# EAGLE design RPM meter (EAGLE 6.4)
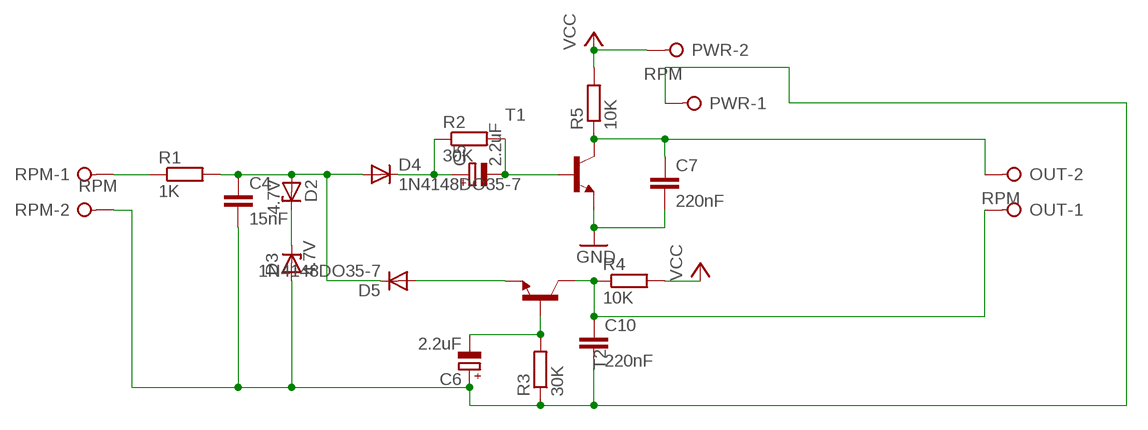
[diagram p0: schematic, sheet 1]

## Parts
C4  15nF  C-EU025-024X044  [C025-024X044]
C5  2.2uF  CPOL-EUE1.8-4  [E1,8-4]
C6  2.2uF  CPOL-EUE1.8-4  [E1,8-4]
C7  220nF  C-EU025-024X044  [C025-024X044]
C10  220nF  C-EU025-024X044  [C025-024X044]
D2  4.7V  ZENER-DIODEZD-10  [ZDIO-10]
D3  4.7V  ZENER-DIODEZD-10  [ZDIO-10]
D4  1N4148DO35-7  [DO35-7]
D5  1N4148DO35-7  [DO35-7]
OUT  RPM  W237-02P  [W237-132]
PWR  RPM  W237-02P  [W237-132]
R1  1K  R-EU_0207/7  [0207/7]
R2  30K  R-EU_0207/7  [0207/7]
R3  30K  R-EU_0207/7  [0207/7]
R4  10K  R-EU_0207/7  [0207/7]
R5  10K  R-EU_0207/7  [0207/7]
RPM  RPM  W237-02P  [W237-132]
T1  2N2222-NPN-TO92-EBC  [TO92-EBC]
T2  2N2222-NPN-TO92-EBC  [TO92-EBC]

## Nets
GND: C7.2 T1.E
N$1: C4.2 C6.+ C10.2 D3.A PWR.1 R3.1 RPM.2
N$9: R1.1 RPM.1
N$13: C4.1 D2.A D4.A D5.C R1.2
N$14: C7.1 OUT.2 R5.1 T1.C
N$20: D2.C D3.C
N$21: C5.+ D4.C R2.1
N$22: C5.- R2.2 T1.B
N$24: D5.A T2.E
N$26: C6.- R3.2 T2.B
N$28: C10.1 OUT.1 R4.1 T2.C
VCC: PWR.2 R4.2 R5.2

## Library data of the parts
C4 C7 C10 = rcl:C-EU: CAPACITOR, European symbol
C5 C6 = rcl:CPOL-EU: POLARIZED CAPACITOR, European symbol
D2 D3 = diode:ZENER-DIODE: Z-Diode
D4 D5 = diode:1N4148: DIODE high speed (Philips)
OUT PWR RPM = con-wago-508:W237-02P: WAGO SREW CLAMP; OC_FARNELL: unknown; OC_NEWARK: unknown
R1-R5 = rcl:R-EU_: RESISTOR, European symbol
T1 T2 = transistor-neu-to92:*-NPN-: NPN Transistror

## Board
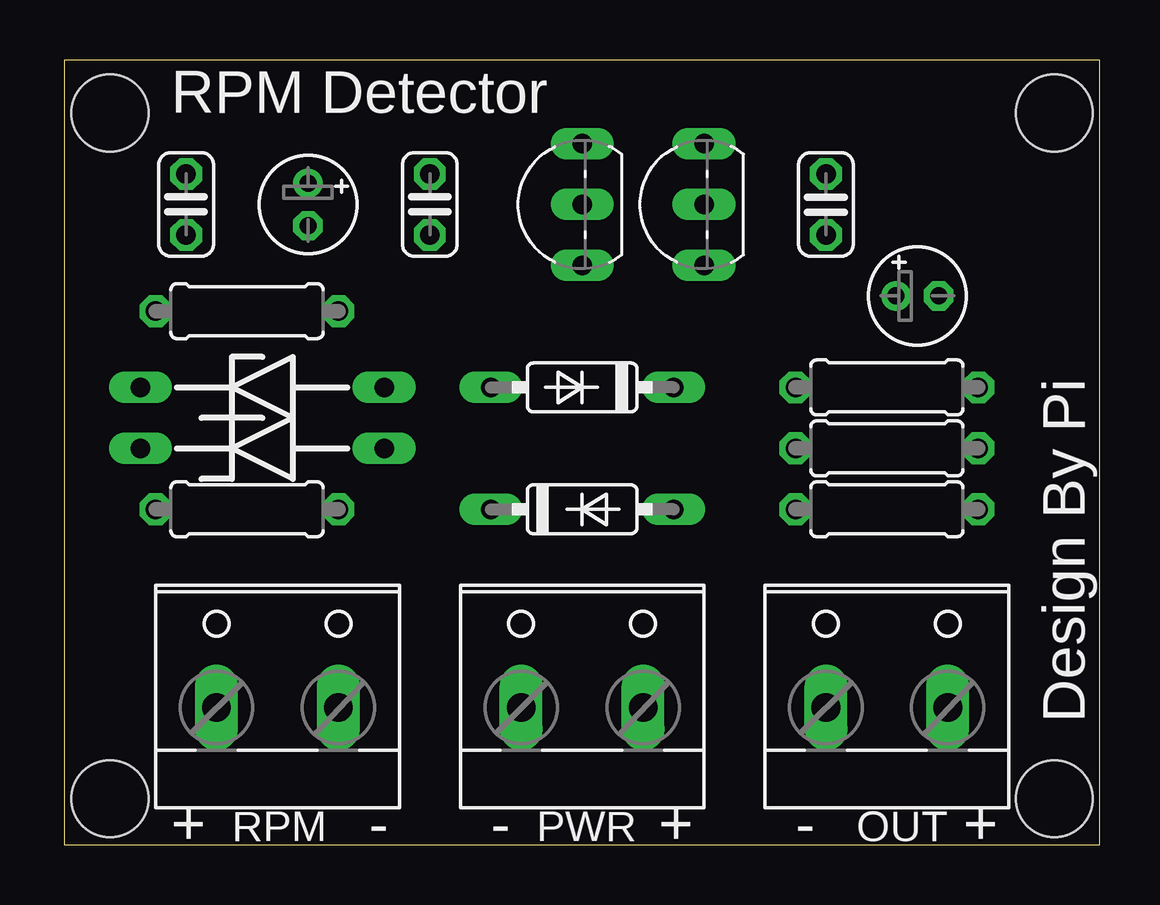
[diagram p1: board, top side]
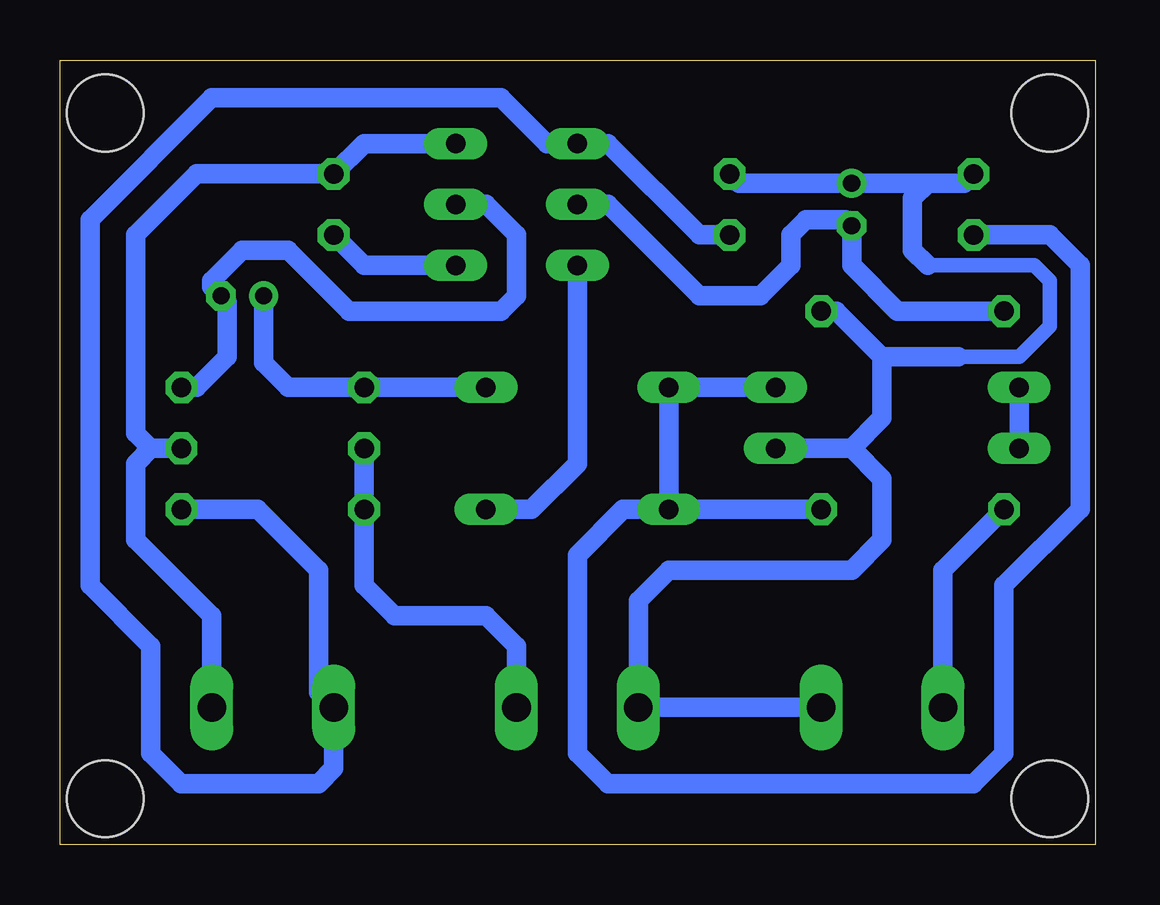
[diagram p2: board, bottom side, seen from below]

Size 43.16 x 32.69 mm. Coordinates in mm from the lower left corner, seen from the top.
Outline: 0,0 43.16,0 43.16,32.69 0,32.69 0,0
Copper layers (1*16): Top 0.035mm / dielectric 1.5mm / Bottom 0.035mm
Design rules "default": minimum track width 10mil, minimum drill 24mil, track to track 8mil, track to pad 8mil, pad to pad 8mil, via to via 8mil, smd to smd 8mil, copper to edge 40mil, drill to drill 8mil, minimum pad ring 10mil, minimum via ring 8mil, stop-mask expansion 4mil, vias tented up to drill 0mil, thermal gap 10mil
Holes 3.2 mm at 1.91,30.48 1.91,1.91 41.27,1.91 41.27,30.48

### Footprints (pad centres in the part's own frame; a part is rotated, then mirrored left to right if it is on the bottom)
C025-024X044 = drill 0.813 octagon: 1 -1.27,0; 2 1.27,0
E1,8-4 = drill 0.711 pad 1.168: + -0.889,0 | drill 0.711 pad 1.168 octagon: - 0.889,0
ZDIO-10 = drill 0.813 long: A 5.08,0; C -5.08,0
DO35-7 = drill 0.813 long: A 3.81,0; C -3.81,0
W237-132 = drill 1.194 long: 1 -2.54,-0.635; 2 2.54,-0.635
0207/7 = drill 0.813 octagon: 1 -3.81,0; 2 3.81,0
TO92-EBC = drill 0.813 long: B 0,-1.27; C 2.54,-1.27; E -2.54,-1.27

### Placement (x,y rotation side)
C4  5.08,26.67 90 top
C5  35.56,22.86 0 top
C6  10.16,26.67 270 top
C7  31.75,26.67 270 top
C10  15.24,26.67 90 top
D2  8.25,19.05 0 top
D3  8.25,16.51 0 top
D4  21.59,19.05 180 top
D5  21.59,13.97 0 top
OUT  34.29,6.35 0 top
PWR  21.59,6.35 0 top
R1  7.62,13.97 0 top
R2  34.29,19.05 0 top
R3  7.62,22.23 180 top
R4  34.29,13.97 180 top
R5  34.29,16.51 180 top
RPM  8.89,6.35 0 top
T1  25.4,26.67 90 top
T2  20.32,26.67 90 top

### Tracks (layer width: path | path; a pad name or v marks a point on that pad's centre or on a via)
GND
  Bottom 0.813: T1.E 30.48,24.13 C7.2
N$1
  Bottom 0.61: 6.99,24.13 2.54,24.13 1.91,23.5 1.91,21.59 3.17,20.32 6.35,20.32
  Bottom 0.813: D3.A 10.16,16.51 | 10.16,16.51 8.89,15.24 8.89,12.7 10.16,11.43 17.78,11.43 19.05,10.16 PWR.1 RPM.2 | 8.89,20.32 8.89,17.78 10.16,16.51 | 6.99,27.56 C6.+ 14.86,27.56 C10.2 | 6.99,27.56 5.46,27.56 C4.2 | 8.89,20.32 10.8,22.23 R3.1 | 8.89,20.32 6.35,20.32 5.72,20.32 | 6.99,24.13 7.62,24.77 7.62,26.92 6.99,27.56
N$9
  Bottom 0.813: RPM.1 6.35,11.43 R1.1
N$13
  Bottom 0.813: R1.2 D5.C | D5.C D4.A D2.A | D5.C 19.69,13.97 21.59,12.06 21.59,3.81 20.32,2.54 5.08,2.54 3.81,3.81 3.81,10.79 0.63,13.97 0.63,24.13 1.91,25.4 C4.1
N$14
  Bottom 0.813: OUT.2 36.83,9.53 40.01,12.7 40.01,15.88 39.37,16.51 | 39.37,16.51 R5.1 | T1.C 30.48,29.21 C7.1 37.47,27.94 40.01,25.4 40.01,17.14 39.37,16.51
N$20
  Bottom 0.813: D3.C D2.C
N$21
  Bottom 0.813: D4.C R2.1 33.66,19.05 34.67,20.07 C5.+
N$22
  Bottom 0.813: T1.B 25.4,26.67 24.13,25.4 24.13,22.86 24.77,22.23 31.12,22.23 33.66,24.77 35.56,24.77 36.83,23.5 36.83,23.24 C5.- 36.2,22.61 36.2,20.32 37.47,19.05 R2.2
N$24
  Bottom 0.813: T2.E 21.59,15.88 23.5,13.97 D5.A
N$26
  Bottom 0.813: T2.B 20.32,26.67 16.51,22.86 13.97,22.86 12.7,24.13 12.7,25.4 12.07,26.04 10.41,26.04 C6.- 10.16,24.13 8.25,22.23 R3.2
N$28
  Bottom 0.813: C10.1 16.51,25.4 20.32,29.21 T2.C 22.86,29.21 24.77,31.11 36.83,31.11 41.91,26.04 41.91,10.79 39.37,8.26 39.37,3.81 38.1,2.54 32.38,2.54 31.75,3.17 OUT.1 32.38,6.35 32.38,11.43 34.93,13.97 R4.1
VCC
  Bottom 0.813: R5.2 R4.2 30.48,10.79 29.21,9.53 25.4,9.53 24.13,8.26 PWR.2

### Text on the board
tNames: RPM Detector | Design By Pi | + | - | - | + | - | +